# Altium schematic sheet B293A CoX Amp Top.SchDoc
size A4
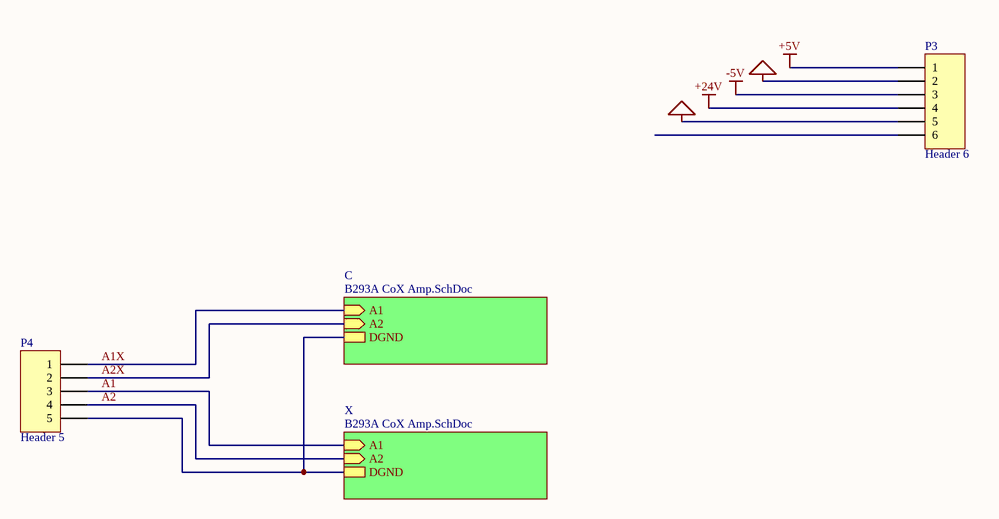
[diagram p0: B293A CoX Amp Top.SchDoc]

## Parts
P3  Header 6  [SL 6W Vertical with latch]
P4  Header 5  [SL 5W Vertical with latch]

## Sub-sheets
C = B293A CoX Amp.SchDoc: A2 (in), A1 (in), DGND
X = B293A CoX Amp.SchDoc: A2 (in), A1 (in), DGND

## Nets
+5V: P3.1
+24V: P3.4
-5V: P3.3
GND: P3.2 P3.5
A1: P4.3 ; sheet X/A1
A1X: P4.1 ; sheet C/A1
A2: P4.4 ; sheet X/A2
A2X: P4.2 ; sheet C/A2
NetP4_5: P4.5 ; sheet C/DGND, sheet X/DGND

Not connected (* = marked no-connect by the designer): P3 6

## Library data of the parts
P3 = Header 6: Header, 6-Pin; LatestRevisionDate: 17-Jul-2002; LatestRevisionNote: Re-released for DXP Platform.; Publisher: Altium Limited
P4 = Header 5: Header, 5-Pin; LatestRevisionDate: 17-Jul-2002; LatestRevisionNote: Re-released for DXP Platform.; Publisher: Altium Limited